# Altium project MetalDetector.PrjPcb
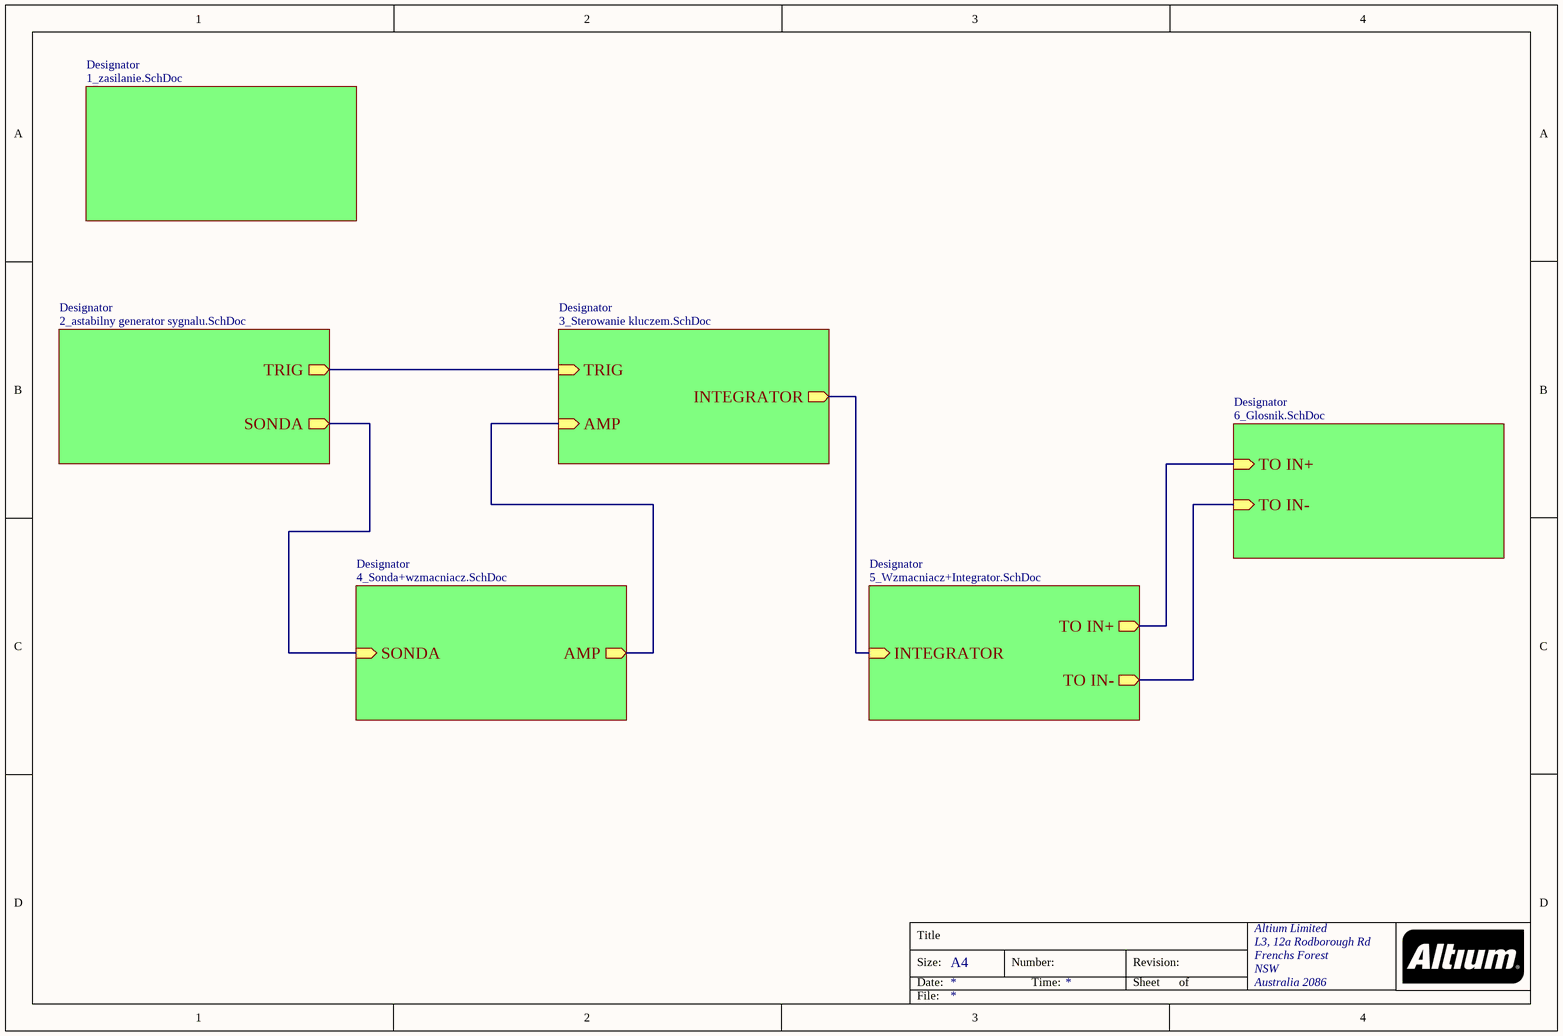
[diagram p0: Blokowy.SchDoc]
7 sheets, 64 parts. Net scope: hierarchical (ports join the sheet entries above them; power ports are global).
Board file: PCB2.PcbDoc
Sheets:
  Blokowy.SchDoc
    Designator = 1_zasilanie.SchDoc
    Designator = 2_astabilny generator sygnalu.SchDoc
    Designator = 3_Sterowanie kluczem.SchDoc
    Designator = 4_Sonda+wzmacniacz.SchDoc
    Designator = 5_Wzmacniacz+Integrator.SchDoc
    Designator = 6_Glosnik.SchDoc

## Sheet Blokowy.SchDoc
size A4; Organization: Altium Limited; Address1: L3, 12a Rodborough Rd; Address2: Frenchs Forest; Address3: NSW; Address4: Australia 2086

### Sub-sheets
Designator = 1_zasilanie.SchDoc: no entries
Designator = 2_astabilny generator sygnalu.SchDoc: TRIG (out), SONDA (out)
Designator = 3_Sterowanie kluczem.SchDoc: TRIG (in), AMP (in), INTEGRATOR (out)
Designator = 4_Sonda+wzmacniacz.SchDoc: SONDA (in), AMP (out)
Designator = 5_Wzmacniacz+Integrator.SchDoc: INTEGRATOR (in), TO IN+ (out), TO IN- (out)
Designator = 6_Glosnik.SchDoc: TO IN+ (in), TO IN- (in)

### Nets
NetC14_1: sheet Designator/AMP, sheet Designator/AMP
NetP2_1: sheet Designator/SONDA, sheet Designator/SONDA
NetPR2_3: sheet Designator/INTEGRATOR, sheet Designator/INTEGRATOR
NetR3_1: sheet Designator/TRIG, sheet Designator/TRIG
NetR16_1: sheet Designator/TO IN-, sheet Designator/TO IN-
NetR18_1: sheet Designator/TO IN+, sheet Designator/TO IN+

### Notes on the sheet
- Title
- Size:
- Date:
- A4
- Number:
- Time:
- Revision:
- Sheet
- of
- File:

## Sheet 1_zasilanie.SchDoc
size A4
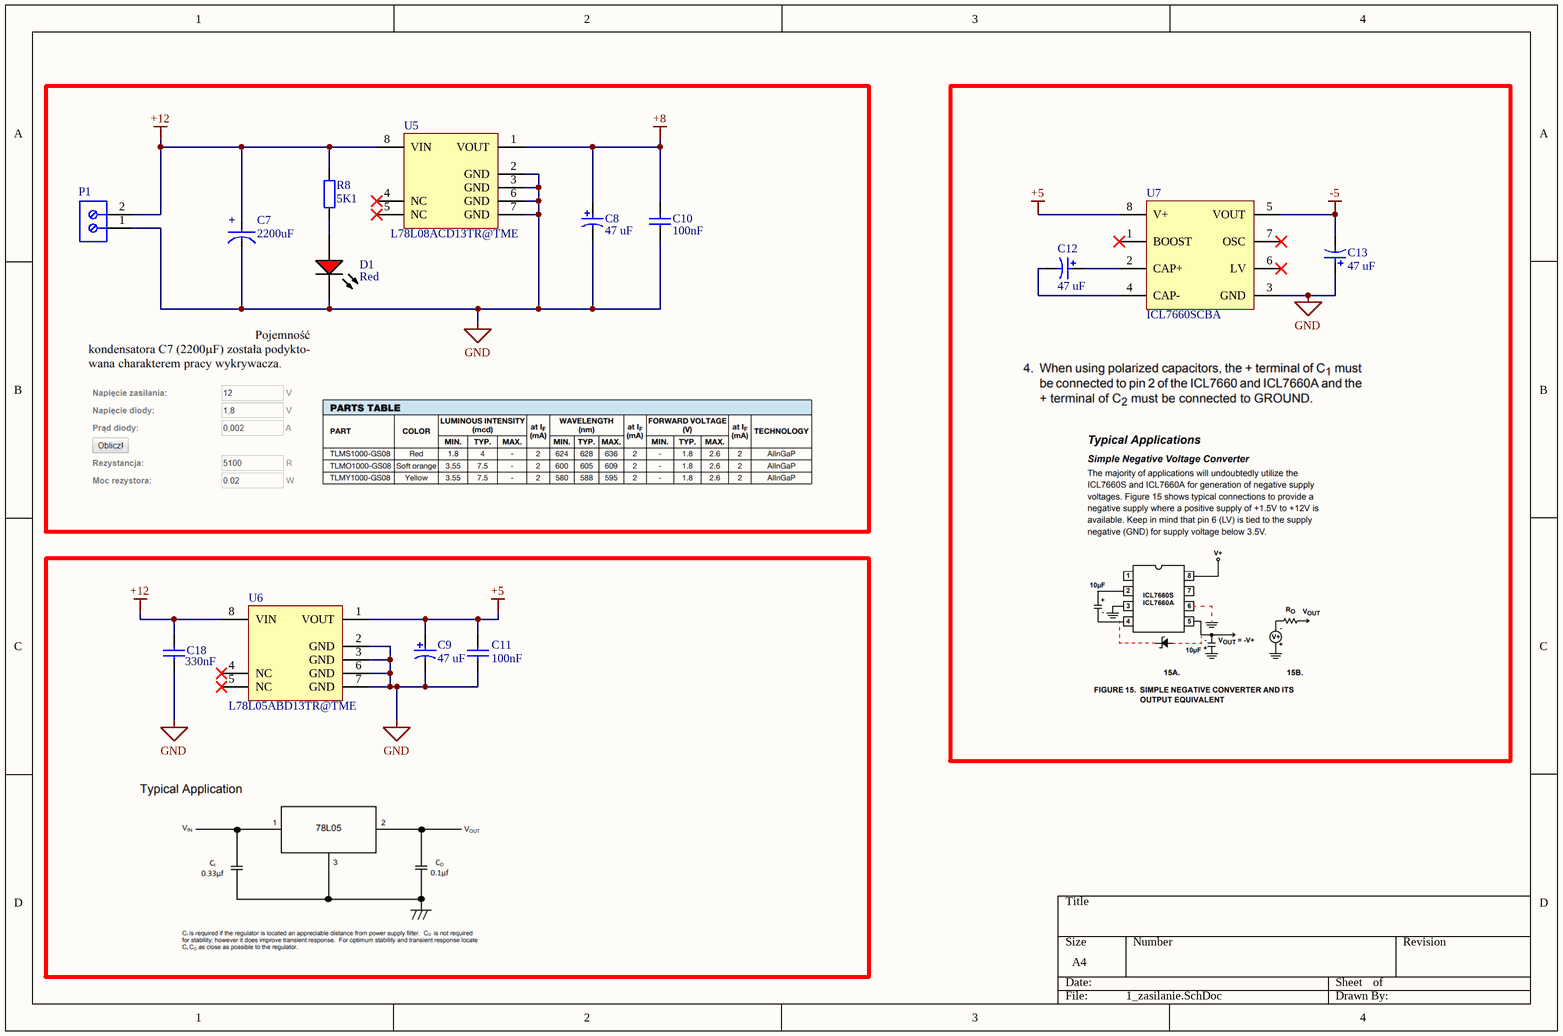
[diagram p1: 1_zasilanie.SchDoc]

### Parts
C7  Capacitance: 2200uF  [18 X 25mm Radial 7.5mm]  (hidden comment: Cap Electrolytic)
C8  Rated Capacitance: 47 uF  [NIC-CAPA2-6.3X5.8_V]  (hidden comment: UUD1E470MCL1GS)
C9  Rated Capacitance: 47 uF  [NIC-CAPA2-6.3X5.8_V]  (hidden comment: UUD1E470MCL1GS)
C10  Capacitance: 100nF  [0603]  (hidden comment: CL10B104KA8NNNC@TME)
C11  Capacitance: 100nF  [0603]  (hidden comment: CL10B104KA8NNNC@TME)
C12  Rated Capacitance: 47 uF  [NIC-CAPA2-6.3X5.8_V]  (hidden comment: UUD1E470MCL1GS)
C13  Rated Capacitance: 47 uF  [NIC-CAPA2-6.3X5.8_V]  (hidden comment: UUD1E470MCL1GS)
C18  value 330nF  [CAPC1608X90X35ML15T15]  (hidden comment: 0603YD334KAT2A)
D1  LED Colour: Red  [VISH-TLMS1000_V]  (hidden comment: TLMS1000-GS08)
P1  282836-2@TME  [TECO-282836-2_V]  (value not drawn)
R8  value 5K1  [R1206]  (hidden comment: 1206S4J0102T5E@TME)
U5  L78L08ACD13TR@TME  [SO8_M]
U6  L78L05ABD13TR@TME  [SO8_N]
U7  ICL7660SCBA  [INTS-SOIC-8_V]

### Nets
+5: C9.1 C11.1 U6.1(VOUT) U7.8(V+)
+8: C8.1 C10.1 U5.1(VOUT)
+12: C7.2(+) C18.1 P1.2(-) R8.2 U5.8(VIN) U6.8(VIN)
-5: C13.2 U7.5(VOUT)
GND: C7.1(-) C8.2 C9.2 C10.2 C11.2 C13.1 C18.2 D1.2(K) P1.1(+) U5.2(GND) U5.3(GND) U5.6(GND) U5.7(GND) U6.2(GND) U6.3(GND) U6.6(GND) U6.7(GND) U7.3(GND)
NetC12_1: C12.1 U7.2(CAP+)
NetC12_2: C12.2 U7.4(CAP-)
NetD1_1: D1.1(A) R8.1

Not connected (* = marked no-connect by the designer): U5 4(NC)* 5(NC)*; U6 4(NC)* 5(NC)*; U7 1(BOOST)* 6(LV)* 7(OSC)*

### Library data of the parts
C7 = Cap Electrolytic: CAPACITOR ALUM 2200UF 20% 35V RADIAL
C8 C9 C12 C13 = CMP-0687-00039-1: Aluminum Electrolytic Capacitor, UD Series, Low Impedance, 47 uF, 25 V, + / - 20%, -55 to 105 degC, Chip Type, 6.3 x 5.8 mm D x L, Pb-Free, Reel; Manufacturer: Nichicon; Rated Ripple Current (at 100kHz): 230 mA; Endurance Time: 2000 h; Packing: Dia382mm Reel; Rated Voltage: 25 V; Impedance: 0.44 Ohm; Tolerance Rated Capacitance: -20 to 20%; Mounting Technology: Surface Mount; Diameter: 6.3 mm; PartNumber: UUD1E470MCL1GS; ComponentLink3Description: Package Specification; ComponentLink2Description: Datasheet; PackageReference: CAPAE-D6.3H5.8; RoHS: TRUE; Length: 5.8 mm; ComponentLink1URL: http://www.nichicon.co.jp/; PackageDescription: 2-Pin Surface Mount Device, Diameter 6.3 mm, Height 5.8 mm, Pitch 5.4 mm; ComponentLink2URL: http://products.nichicon.co.jp/en/pdf/XJA043/e-ud.pdf; ComponentLink1Description: Manufacturer URL; ComponentLink3URL: http://products.nichicon.co.jp/en/pdf/XJA043/e-ud.pdf; DatasheetVersion: 08/2012
C10 C11 = Cap: Capacitor
C18 = CMP-2006-04538-1: Manufacturer: AVX Interconnect / Elco; Part Number: 0603YD334KAT2A
D1 = CMP-2000-07254-1: Low Current LED, 40 mW, 1.8 V, -40 to 100 degC, 2-Pin SMD (0603), RoHS, Tape and Reel; Manufacturer: Vishay; Lens Shape: Rectangular; Automotive Qualification Standard: AEC-Q100; Wavelength Typ: 636nm; SVHC: ToBeAdvised; Bulb Size: 1.6mmx0.8mm; Forward Voltage: 1.8V; Luminous Intensity: 4mcd; Forward Current If: 2mA; Viewing Angle: 80°; Datasheet Version: Rev. 1.7, 02/2011; Datasheet URL: https://datasheet.ciiva.com/5798/1698881-5798337.pdf; LED Mounting: SMD; Packaging: CutTape; Package Reference: TLMS1000; Manufacturer URL: http://www.vishay.com/; Mounting Technology: SurfaceMount; Product Range: -; Package Description: 2-Pin Surface Mount Device, Body 1.6 x 0.8 mm; MSL: MSL2-1year
P1 = CMP-1684-00017-1: Female Header, Pitch 5 mm, 1 x 2 Position, Height 10 mm, Tail Length 3.5 mm, Rohs, Bulk; Manufacturer: TE Connectivity; Wire Gauge: 16-30AWG; Product Training Modules: Wire-to-BoardEurostyleTerminalBlocks; Clamp Material - Plating: Brass-NickelPlated; Voltage: 300V; Mating Orientation: HorizontalwithBoard; Current: 13.5A; Pitch: 0.197"(5.00mm); Screw Thread: M3; 3D Model: 282836-2.pdf; Other Names: 5ULV-02B / A98076; Dynamic Catalog: BuchananSeries; Number of Levels: 1; Torque - Screw: 0.68Nm(6Lb-In); Featured Product: EurostyleTerminalBlockConnectors; Positions Per Level: 2; Wire Termination: Screw-RisingCageClamp; Datasheet URL: http://www.te.com.cn/commerce/DocumentDelivery/DDEController?Action=showdoc&DocId=Catalog+Section%7F1308389_EUROSTYLE_TERMINAL_BLOCKS%7F0607%7Fpdf%7FEnglish%7FENG_CS_1308389_EUROSTYLE_TERMINAL_BLOCKS_0607.pdf%7F282836-2; Color: Green; Family: TerminalBlocks-WiretoBoard; RoHS Information: 282836-2StatementofCompliance; Standard Package: 300; Contact Material - Plating: Brass-TinPlated; Manufacturer URL: http://www.te.com; Housing Material: Polyamide(PA66),Nylon6/6; Features: Interlocking(Side); Package Description: Female Header, Pitch 5 mm, 1 x 2 Position, Height 10 mm, Tail Length 3.5 mm; Mounting Type: ThroughHole; Package Reference: THD; Packaging: Bulk; Series: Buchanan; Category: Connectors,Interconnects; Screw Material - Plating: Brass-NickelPlated
R8 = Res: Resistor
U5 = CMP-0244-00234-1: Positive Voltage Regulator, 8V, 8-Pin SO, Tape and Reel; PackageVersion: 1/12/2002; DatasheetVersion: 1/02/2011; Code_IPC: SOIC127P600-8; PackageDescription: 8-Pin Small Outline Integrated Circuit 1.27 mm Pitch; ComponentLink3Description: Package Specification; Code_JEDEC: MS-012-AA; PackageReference: SO8; ComponentLink3URL: http://www.st.com/internet/com/TECHNICAL_RESOURCES/TECHNICAL_LITERATURE/PACKAGE_INFORMATION/CD00004680.pdf; ComponentLink1Description: Manufacturer URL; ComponentLink2Description: Datasheet; ComponentLink2URL: http://www.st.com/internet/com/TECHNICAL_RESOURCES/TECHNICAL_LITERATURE/DATASHEET/CD00000446.pdf; ComponentLink1URL: http://www.st.com
U6 = CMP-0244-00242-1: Positive Voltage Regulator, 5V, 8-Pin SO, Tape and Reel; ComponentLink2URL: http://www.st.com/internet/com/TECHNICAL_RESOURCES/TECHNICAL_LITERATURE/DATASHEET/CD00000446.pdf; ComponentLink3URL: http://www.st.com/internet/com/TECHNICAL_RESOURCES/TECHNICAL_LITERATURE/PACKAGE_INFORMATION/CD00004680.pdf; Code_IPC: SOIC127P600-8; PackageDescription: 8-Pin Small Outline Integrated Circuit 1.27 mm Pitch; ComponentLink3Description: Package Specification; ComponentLink2Description: Datasheet; DatasheetVersion: 1/02/2011; PackageVersion: 1/12/2002; Code_JEDEC: MS-012-AA; ComponentLink1URL: http://www.st.com; ComponentLink1Description: Manufacturer URL; PackageReference: SO8
U7 = CMP-2000-06437-1: Charge Pump Switching Regulator IC Positive or Negative Fixed, 1.5 to 12 V, 0 to 70 degC, RoHS, Tube; Manufacturer: Intersil; Number of Outputs: 1; Frequency - Switching: 10kHz,35kHz; Dynamic Catalog: InvertingIC; Current - Output: 45mA; Voltage - Input: 1.5V~12V; Output Type: Adjustable; Synchronous Rectifier: No; Voltage - Output: -1.5V~-12V,±3V~±24V; Package URL: http://www.intersil.com/content/dam/Intersil/documents/m8_1/m8.15.pdf; Standard Package: 98; Type: SwitchedCapacitor(ChargePump),Doubler,Inverting; Datasheet Version: 01/2013; Package Description: 8-Pin Small Outline Integrated Circuit, Body 4.9 x 3.9 mm, Pitch 1.27 mm; Category: IntegratedCircuits(ICs); Operating Temperature: 0°C~70°C; Mounting Technology: SurfaceMount; Package / Case: 8-SOIC(0.154",3.90mmWidth); Mounting Type: SurfaceMount; Series: -; Family: PMIC-VoltageRegulators-DCDCSwitchingRegulators; Packaging: Tube; PWM Type: -; Supplier Device Package: 8-SOIC; Datasheet URL: http://www.intersil.com/content/dam/intersil/documents/icl7/icl7660s-a.pdf; Package Reference: SOIC-8; Manufacturer URL: http://www.intersil.com/en.html

## Sheet 2_astabilny generator sygnalu.SchDoc
size A4
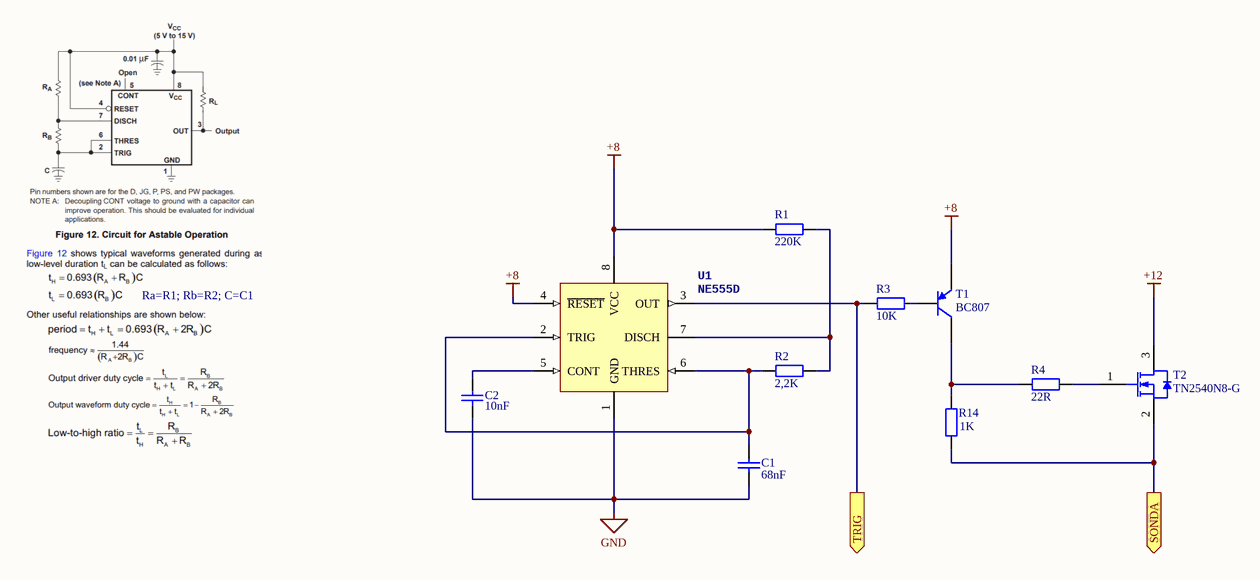
[diagram p2: 2_astabilny generator sygnalu.SchDoc]

### Parts
C1  Capacitance: 68nF  [CAPC1608X95X40NL15T15]  (hidden comment: VJ0603Y683KXJCW1BC)
C2  Capacitance: 10nF  [CAPC1608X92X38NL15T08]  (hidden comment: VJ0603Y103KNAAO)
R1  value 220K  [R1206]  (hidden comment: 1206S4J0224T5E@TME)
R2  value 2,2K  [R1206]  (hidden comment: 1206S4J0222T5E@TME)
R3  value 10K  [R1206]  (hidden comment: 1206S4J0103T5E@TME)
R4  value 22R  [R1206]  (hidden comment: 1206S4J0220T5E@TME)
R14  value 1K  [R1206]  (hidden comment: 1206S4J0102T5E@TME)
T1  BC807  [ONSC-SOT-23-3-318-08_V]
T2  TN2540N8-G  [FAIR-SOT23-3_A_V]
U1  NE555D  [D0008A_N]

### Ports
SONDA (out), TRIG (out)

### Nets
+8: R1.1 T1.2(E) U1.4(~{RESET}) U1.8(VCC)
+12: T2.3(D)
GND: C1.1 C2.1 U1.1(GND)
NetC1_2: C1.2 R2.1 U1.2(TRIG) U1.6(THRES)
NetC2_2: C2.2 U1.5(CONT)
NetP2_1: R14.1 T2.2(S) ; port SONDA
NetR1_2: R1.2 R2.2 U1.7(DISCH)
NetR3_1: R3.1 U1.3(OUT) ; port TRIG
NetR3_2: R3.2 T1.1(B)
NetR4_1: R4.1 R14.2 T1.3(C)
NetR4_2: R4.2 T2.1(G)

### Notes on the sheet
- Ra=R1; Rb=R2; C=C1

### Library data of the parts
C1 = CMP-2006-01832-1: Manufacturer: Vitramon; Part Number: VJ0603Y683KXJCW1BC
C2 = CMP-2006-01968-1: Manufacturer: Vitramon; Part Number: VJ0603Y103KNAAO
R1-R4 R14 = Res: Resistor
T1 = CMP-1048-00691-1: General Purpose Transistor, PNP Silicon, 3-Pin SOT-23, Pb-Free, Tape and Reel; Manufacturer: On Semiconductor; PartNumber: BC807-25LT1G; IC Continuous (A): -0.5; fT Min (MHz): 100; PackageDescription: 3-Pin Small Outline Transistor, Body 2.92 x 1.3 mm, Pitch 0.95 mm; Polarity: PNP; ComponentLink2URL: http://www.onsemi.com/pub_link/Collateral/BC807-16LT1-D.PDF; PackageReference: SOT-23-3-318-08; ComponentLink2Description: Datasheet; ComponentLink1Description: Manufacturer URL; ComponentLink3URL: http://www.onsemi.cn/pub_link/Collateral/318-08.PDF; Packing: Tape and Reel; DatasheetVersion: Rev. 10; RoHS: TRUE; ComponentLink3Description: Package Specification; PackageVersion: Rev. AP, 11/2009; ComponentLink1URL: http://www.onsemi.com/; Mounting Technology: Surface Mount
T2 = CMP-2000-06254-1: N-Channel Logic Level PowerTrench(TM) MOSFET, 30 V, 2.7 A, -55 to 150 degC, 3-Pin SOT23, RoHS, Tape and Reel; Manufacturer: FairchildSemiconductor; RDS-on: 46@10VmOhm; Rad Hard: No; Typical Turn-On Delay Time: 6ns; Typical Fall Time: 4ns; Channel Mode: Enhancement; Channel Type: N; Maximum Drain Source Voltage: 30V; Maximum Continuous Drain Current: 2.7A; Typical Rise Time: 13ns; Typical Turn-Off Delay Time: 15ns; Maximum Gate Source Voltage: ±20V; Package: 3SuperSOT; Category: MOSFET; Datasheet Version: Rev. C, 04/1999; Packaging: Tape&Reel; Operating Temperature: -55to150°C; Package Reference: SOT23-3; Datasheet URL: https://www.fairchildsemi.com/datasheets/FD/FDN359AN.pdf; Manufacturer URL: https://www.fairchildsemi.com/; Mounting: SurfaceMount; Mounting Technology: SurfaceMount; Package Description: 3-Pin Small Outline Transistor, Body 2.92 x 1.4 mm, Pitch 0.95 mm; Package URL: https://www.fairchildsemi.com/package-drawings/MA/MA03B.pdf
U1 = CMP-2000-06840-1: Precision Timer, 4.5 to 16 V, 0 to 70 degC, 8-Pin SOIC (D), Green (RoHS & no Sb/Br), Tube; PartNumber: NE555; Manufacturer: Texas Instruments; Base Number: 555; No. of Timers: 1; Supply Voltage Min: 4.5V; Operating Frequency Max: 0.5MHz; Supply Voltage Range: 4.5Vto16V; No. of Pins: 8; Supply Voltage Max: 16V; IC Temperature Range: Commercial; SVHC: NoSVHC(19-Dec-2012); Operating Mode: Astable,Monostable; Frequency: 500kHz; Package Description: 8-Pin Small Outline Integrated Circuit, Body 4.9 x 3.9 mm, Pitch 1.27 mm; Datasheet URL: http://www.ti.com/general/docs/lit/getliterature.tsp?genericPartNumber=NE555&fileType=pdf; Mounting Technology: SurfaceMount; Operating Temperature Range: 0°Cto+70°C; Operating Temperature Min: 0°C; Package URL: http://www.ti.com/lit/ml/msoi002j/msoi002j.pdf; Datasheet Version: Rev. I, 09/2014; Manufacturer URL: http://www.ti.com/; Digital IC Case Style: SOIC; Clock External Input: No; Logic Function Number: 555; IC Generic Number: 555; No. of Channels: 1; Operating Temperature Max: 70°C; Package / Case: SOIC; Package Reference: D8; Device Marking: NE555D

## Sheet 3_Sterowanie kluczem.SchDoc
size A4
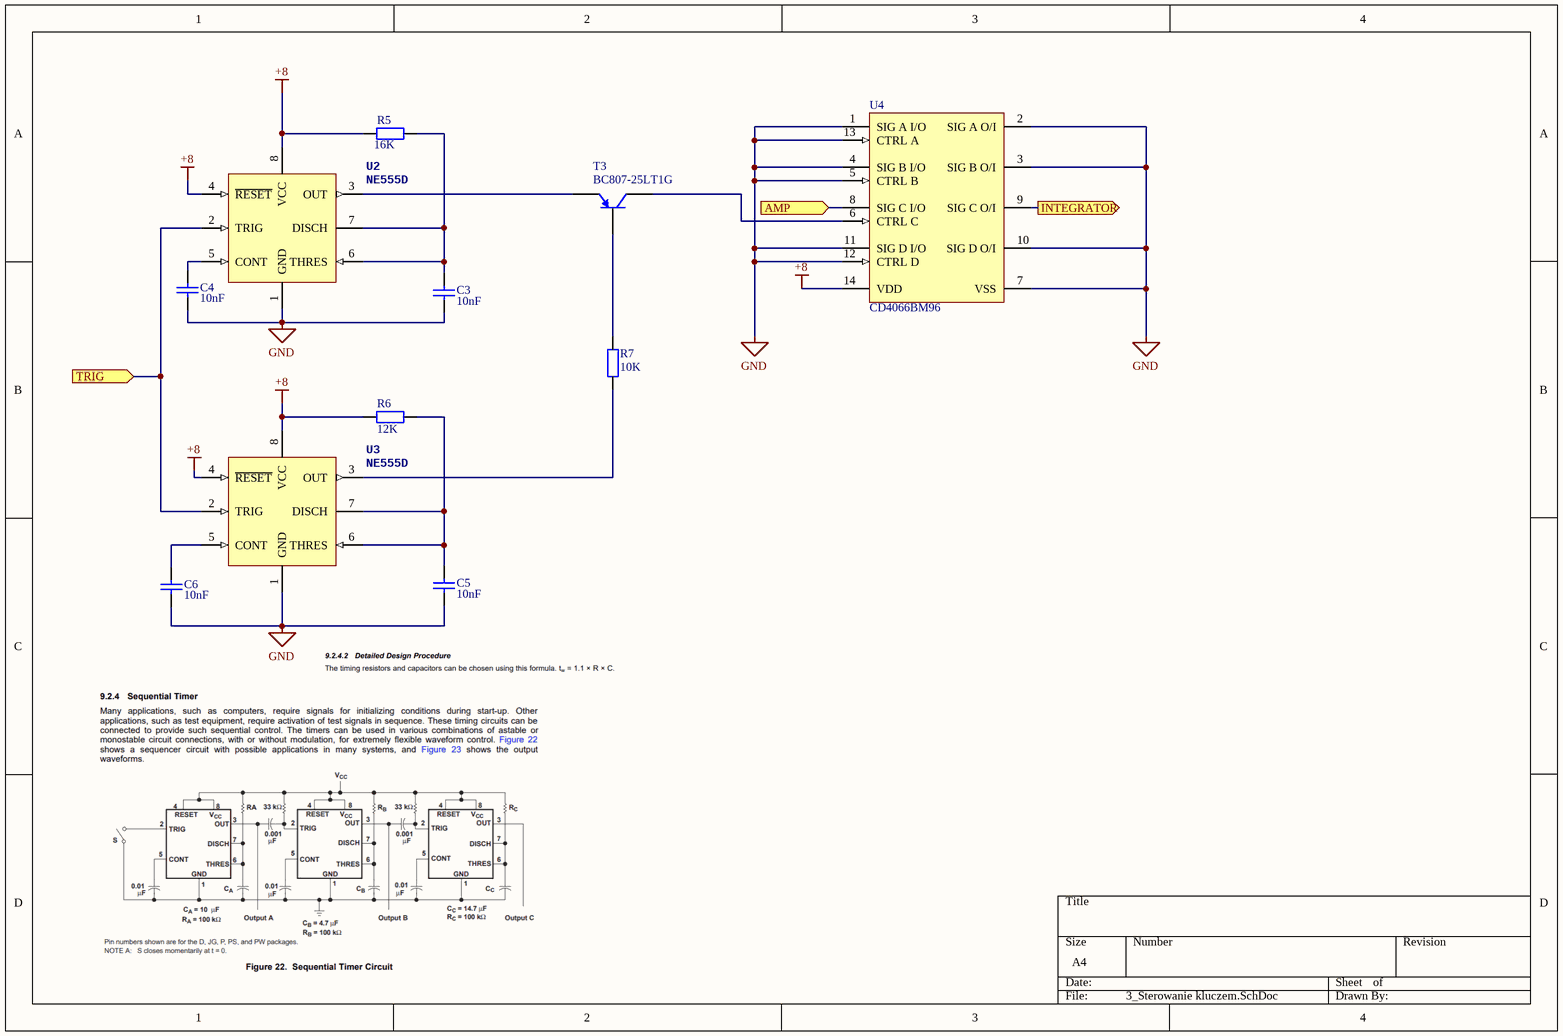
[diagram p3: 3_Sterowanie kluczem.SchDoc]

### Parts
C3  Capacitance: 10nF  [CAPC1608X92X38NL15T08]  (hidden comment: VJ0603Y103KNAAO)
C4  Capacitance: 10nF  [CAPC1608X92X38NL15T08]  (hidden comment: VJ0603Y103KNAAO)
C5  Capacitance: 10nF  [CAPC1608X92X38NL15T08]  (hidden comment: VJ0603Y103KNAAO)
C6  Capacitance: 10nF  [CAPC1608X92X38NL15T08]  (hidden comment: VJ0603Y103KNAAO)
R5  value 16K  [R1206]  (hidden comment: 1206S4J0163T5E@TME)
R6  value 12K  [R1206]  (hidden comment: 1206S4J0123T5E@TME)
R7  value 10K  [R1206]  (hidden comment: Resistor)
T3  BC807-25LT1G  [ONSC-SOT-23-3-318-08_V]
U2  NE555D  [D0008A_N]
U3  NE555D  [D0008A_N]
U4  CD4066BM96  [D0014A_M]

### Ports
AMP (in), INTEGRATOR (out), TRIG (in)

### Nets
+8: R5.1 R6.1 U2.4(~{RESET}) U2.8(VCC) U3.4(~{RESET}) U3.8(VCC) U4.14(VDD)
GND: C3.1 C4.1 C5.1 C6.1 U2.1(GND) U3.1(GND) U4.1(SIG_A_I/O) U4.2(SIG_A_O/I) U4.3(SIG_B_O/I) U4.4(SIG_B_I/O) U4.5(CTRL_B) U4.7(VSS) U4.10(SIG_D_O/I) U4.11(SIG_D_I/O) U4.12(CTRL_D) U4.13(CTRL_A)
NetC3_2: C3.2 R5.2 U2.6(THRES) U2.7(DISCH)
NetC4_2: C4.2 U2.5(CONT)
NetC5_2: C5.2 R6.2 U3.6(THRES) U3.7(DISCH)
NetC6_2: C6.2 U3.5(CONT)
NetC14_1: U4.8(SIG_C_I/O) ; port AMP
NetPR2_3: U4.9(SIG_C_O/I) ; port INTEGRATOR
NetR3_1: U2.2(TRIG) U3.2(TRIG) ; port TRIG
NetR7_1: R7.1 U3.3(OUT)
NetR7_2: R7.2 T3.1(B)
NetT3_2: T3.2(E) U2.3(OUT)
NetT3_3: T3.3(C) U4.6(CTRL_C)

### Library data of the parts
C3-C6 = CMP-2006-01968-1: Manufacturer: Vitramon; Part Number: VJ0603Y103KNAAO
R5 R6 = Res2: Resistor; Published: 8-Jun-2000; LatestRevisionDate: 17-Jul-2002; LatestRevisionNote: Re-released for DXP Platform.; PackageReference: AXIAL-0.4; Publisher: Altium Limited; PackageDescription: Axial Device, Thru-Hole; 2 Leads; 0.4 in Pin Spacing
R7 = Res
T3 = CMP-1048-00691-1: General Purpose Transistor, PNP Silicon, 3-Pin SOT-23, Pb-Free, Tape and Reel; Manufacturer: On Semiconductor; IC Continuous (A): -0.5; fT Min (MHz): 100; PackageDescription: 3-Pin Small Outline Transistor, Body 2.92 x 1.3 mm, Pitch 0.95 mm; Polarity: PNP; ComponentLink2URL: http://www.onsemi.com/pub_link/Collateral/BC807-16LT1-D.PDF; PackageReference: SOT-23-3-318-08; ComponentLink2Description: Datasheet; ComponentLink1Description: Manufacturer URL; PartNumber: BC807-25LT1G; ComponentLink3URL: http://www.onsemi.cn/pub_link/Collateral/318-08.PDF; Packing: Tape and Reel; DatasheetVersion: Rev. 10; RoHS: TRUE; ComponentLink3Description: Package Specification; PackageVersion: Rev. AP, 11/2009; ComponentLink1URL: http://www.onsemi.com/; Mounting Technology: Surface Mount
U2 U3 = CMP-2000-06840-1: as U1 on sheet 2_astabilny generator sygnalu; Package Description: 8-Pin Small Outline Integrated Circuit, Body 4.9 x 3.9 mm, Pitch 1.27 mm; Datasheet URL: http://www.ti.com/general/docs/lit/getliterature.tsp?genericPartNumber=NE555&fileType=pdf; Mounting Technology: SurfaceMount; Operating Temperature Range: 0°Cto+70°C; Operating Temperature Min: 0°C; Package URL: http://www.ti.com/lit/ml/msoi002j/msoi002j.pdf; Datasheet Version: Rev. I, 09/2014; Manufacturer URL: http://www.ti.com/; Digital IC Case Style: SOIC; Clock External Input: No; Logic Function Number: 555; IC Generic Number: 555; No. of Channels: 1; Operating Temperature Max: 70°C; Package / Case: SOIC; Package Reference: D8; Device Marking: NE555D
U4 = CMP-1574-00003-3: CMOS Quad Bilateral Switch, D0014A, LARGE T&R; Manufacturer: Texas Instruments; Configuration: 4 X SPST (NO); Crosstalk: Yes; Ron(Max)(Ohms): 240; ICC(Typ)(mA): 0.00002; VCC(Min)(V): 3; Rating: Military; Ron(Typ)(Ohms): 125; Bandwidth(Max)(MHz): 40; VCC(Max)(V): 18; Operating Temperature Range(C): -55 to 125; Code_JEDEC: MS-012; DatasheetVersion: SCHS051D; PackageReference: D0014A; Output Type: CMOS; Generic Part Number: CD4066B; PackageVersion: http://www.ti.com/lit/ml/mpds177g/mpds177g.pdf

## Sheet 4_Sonda+wzmacniacz.SchDoc
size A4
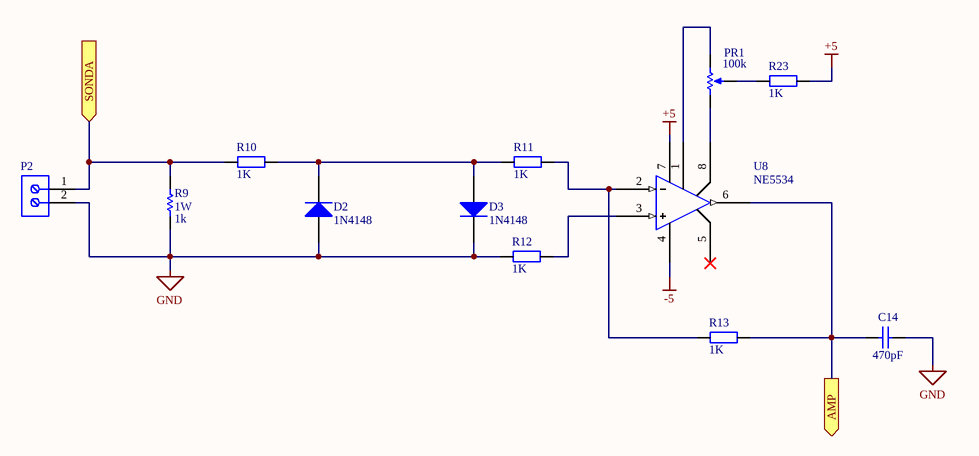
[diagram p4: 4_Sonda+wzmacniacz.SchDoc]

### Parts
C14  Capacitance: 470pF  [KEMT-C315-THT-2]  (hidden comment: CC-470@TME)
D2  1N4148  [DIOD-SOD323-2-A_V]
D3  1N4148  [DIOD-SOD323-2-A_V]
P2  282836-2 / SONDA  [TECO-282836-2_V]  (value not drawn)
PR1  Resistance: 100k  [BOUR-3296W]  (hidden comment: 3296W-1-104LF@TME)
R9  1W  Resistance (Ohms): 1k  [OMTE-RES7X2.5-2]
R10  value 1K  [R1206]  (hidden comment: Resistor)
R11  value 1K  [R1206]  (hidden comment: Resistor)
R12  value 1K  [R1206]  (hidden comment: Resistor)
R13  value 1K  [R1206]  (hidden comment: Resistor)
R23  value 1K  [R1206]  (hidden comment: Resistor)
U8  NE5534  [NE5534 FIXED]

### Ports
AMP (out), SONDA (in)

### Nets
+5: R23.2 U8.7(VCC+)
-5: U8.4(VCC-)
GND: C14.2 D2.1(A) D3.2(K) P2.2 R9.1 R12.1
NetC14_1: C14.1 R13.2 U8.6(OUT) ; port AMP
NetD2_2: D2.2(K) D3.1(A) R10.2 R11.1
NetP2_1: P2.1 R9.2 R10.1 ; port SONDA
NetPR1_1: PR1.1(CCW) U8.8(COMP/BAL)
NetPR1_2: PR1.2(S) R23.1
NetPR1_3: PR1.3(CW) U8.1(BALANCE)
NetR11_2: R11.2 R13.1 U8.2(IN-)
NetR12_2: R12.2 U8.3(IN+)

Not connected (* = marked no-connect by the designer): U8 5(COMP)*

### Library data of the parts
C14 = CMP-1664-00008-1: Capacitor, Ceramic, 22 pF, +/-10 %, 100 V, -55 to 125 degC, 2-Pin THD, RoHS, Bulk; Max Input Voltage: 40 V; Min Input Voltage: 4.2 V; Output Current: 1.5 A; Output Voltage: 1.2 V; Outputs: 1; Case\Package: TO-220; RoHSCompliant: true; Min Operating Temperature: 0 degC; Max Operating Temperature: 125 degC; Package Quantity: 50; ComponentLink2URL: http://capacitoredge.kemet.com/capedge2/DataSheet/Datasheet-C315C220K1G5TA.pdf?pn=C315C220K1G5TA{BULK}; Radiation Hardening: No; Pins: 3; Length: 10.28 mm; ComponentLink1URL: http://www.kemet.com/; ComponentLink2Description: Datasheet; Height: 9.28 mm; REACH SVHC: No SVHC; ComponentLink1Description: Manufacturer URL; Max Ouput Current: 1.5 A; Weight: 0.08113 oz; Packaging: Rail/Tube; DatasheetVersion: Aug-16; Mount: Through Hole; PackageReference: C315-THT-2; Width: 4.82 mm; PackageDescription: 2-Pin Through Hole Device, Body 3.81 x 2.54 mm
D2 D3 = CMP-1667-00004-1: 1N4148WS-7-F / Fast Switching Diode, 75 V, 0.3 A, -65 to 150 degC, 2-Pin SOD323, RoHS, Tape and Reel; DatasheetVersion: Rev. 25-2, 03/2016; PackageDescription: 2-Pin Small Outline Diode, Body 1.7 x 1.3 mm; ComponentLink2Description: Datasheet; ComponentLink1URL: http://www.diodes.com/; PackageReference: SOD323-2; ComponentLink2URL: http://www.diodes.com/datasheets/ds30097.pdf; ComponentLink1Description: Manufacturer URL
P2 = CMP-1684-00017-1: as P1 on sheet 1_zasilanie; Datasheet URL: http://www.te.com.cn/commerce/DocumentDelivery/DDEController?Action=showdoc&DocId=Catalog+Section%7F1308389_EUROSTYLE_TERMINAL_BLOCKS%7F0607%7Fpdf%7FEnglish%7FENG_CS_1308389_EUROSTYLE_TERMINAL_BLOCKS_0607.pdf%7F282836-2; Color: Green; Family: TerminalBlocks-WiretoBoard; RoHS Information: 282836-2StatementofCompliance; Standard Package: 300; Contact Material - Plating: Brass-TinPlated; Manufacturer URL: http://www.te.com; Housing Material: Polyamide(PA66),Nylon6/6; Features: Interlocking(Side); Package Description: Female Header, Pitch 5 mm, 1 x 2 Position, Height 10 mm, Tail Length 3.5 mm; Mounting Type: ThroughHole; Package Reference: THD; Packaging: Bulk; Series: Buchanan; Category: Connectors,Interconnects; Screw Material - Plating: Brass-NickelPlated
PR1 = CMP-1747-00001-1: Square Trimpot(R) Trimming Potentiometer, 10 KOhm, +/- 10%, 0.5 W, -55 to 125 degC, 3-Pin THD, RoHS, Tube; Voltage Rating: 75 V; Tolerance: 1%; Power Rating: 100 mW; Case\Package: 0603; Type (Resistor): Thick Film; PackageDescription: 3-Pin Through Hole Device, Body 9.53 x 4.83 mm, Pitch 2.54 mm; RoHSCompliant: true; Package Quantity: 5000; Case Code (Metric): 1608; PackageReference: 3296W; ComponentLink2Description: Datasheet; REACH SVHC: Unknown; Case Code (Imperial): 0603; ComponentLink1URL: http://www.bourns.com/; Width: 0.85 mm; Radiation Hardening: No; Min Operating Temperature: -55 degC; Mount: Surface Mount; ComponentLink1Description: Manufacturer URL; Max Operating Temperature: 155 degC; Weight: 7.1E-05 oz; Pins: 2; DatasheetVersion: May-16; Packaging: Tape and Reel; Height: 0.45 mm; Length: 1.55 mm; ComponentLink2URL: http://www.bourns.com/docs/Product-Datasheets/3296.pdf
R9 = CMP-2000-06865-1: PartNumber: OD103JE; Manufacturer: Ohmite; Power Rating: 0.25W; Power (Watts): 0.25W,1/4W; Tolerance: ±5%; Online Catalog: OD,OF,OASeries,LittleDemon®; Catalog Drawings: OD,OF,OASeries; EDA / CAD Models: DownloadfromAcceleratedDesigns; Mounting Technology: ThroughHole; Datasheet Version: 06/2016; RoHS Information: LittleDemon"E"SeriesMaterialDeclaration; Number of Terminations: 2; Temperature Coefficient: -; Height: -; Composition: CarbonComposition; Package Description: 2-Pin THD Resistor, Body 7 x 2.5 mm, Lead Dia. 0.6 mm; Size / Dimension: 0.098"Diax0.276"L(2.50mmx7.00mm); Category: Resistors; Manufacturer URL: http://www.ohmite.com/; Features: PulseWithstanding; Family: ThroughHoleResistors; Supplier Device Package: Axial; Package / Case: Axial; Standard Package: 100; Package Reference: RES7X2.5; Operating Temperature: -; Series: LittleDemon®OD; Datasheet URL: http://www.ohmite.com/cat/res_od_of_oa.pdf; Packaging: Bulk
R10-R13 R23 = Res

## Sheet 5_Wzmacniacz+Integrator.SchDoc
size A4
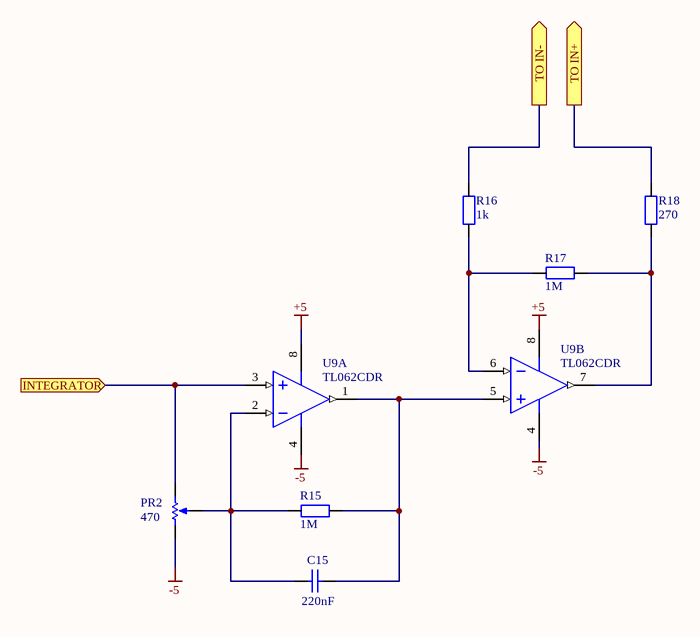
[diagram p5: 5_Wzmacniacz+Integrator.SchDoc]

### Parts
C15  Capacitance: 220nF  [KEMT-C315-THT-2]  (hidden comment: CM-220N@TME)
PR2  Resistance: 470  [BOUR-3296W]  (hidden comment: T910W-50R@TME)
R15  value 1M  [R1206]  (hidden comment: 1206S4J0105T5E@TME)
R16  value 1k  [R1206]  (hidden comment: 1206S4J0102T5E@TME)
R17  value 1M  [R1206]  (hidden comment: 1206S4J0105T5E@TME)
R18  value 270  [R1206]  (hidden comment: 1206S4J0271T5E@TME)
U9  TL062CDR  [D0008A_N]  (parts A,B of 2)

### Ports
INTEGRATOR (in), TO IN+ (out), TO IN- (out)

### Nets
+5: U9.8(VCC+)
-5: PR2.1(CCW) U9.4(VCC-)
NetC15_1: C15.1 PR2.2(S) R15.1 U9.2(IN1-)
NetC15_2: C15.2 R15.2 U9.1(OUT1) U9.5(IN2+)
NetPR2_3: PR2.3(CW) U9.3(IN1+) ; port INTEGRATOR
NetR16_1: R16.1 ; port TO IN-
NetR16_2: R16.2 R17.1 U9.6(IN2-)
NetR17_2: R17.2 R18.2 U9.7(OUT2)
NetR18_1: R18.1 ; port TO IN+

### Library data of the parts
C15 = CMP-1664-00008-1: Model: C315C220K1G5TA; Max Input Voltage: 40 V; Min Input Voltage: 4.2 V; Output Current: 1.5 A; Output Voltage: 1.2 V; Outputs: 1; Case\Package: TO-220; RoHSCompliant: true; Min Operating Temperature: 0 degC; Max Operating Temperature: 125 degC; Package Quantity: 50; ComponentLink2URL: http://capacitoredge.kemet.com/capedge2/DataSheet/Datasheet-C315C220K1G5TA.pdf?pn=C315C220K1G5TA{BULK}; Radiation Hardening: No; Pins: 3; Length: 10.28 mm; ComponentLink1URL: http://www.kemet.com/; ComponentLink2Description: Datasheet; Height: 9.28 mm; REACH SVHC: No SVHC; ComponentLink1Description: Manufacturer URL; Max Ouput Current: 1.5 A; Weight: 0.08113 oz; Packaging: Rail/Tube; DatasheetVersion: Aug-16; Mount: Through Hole; PackageReference: C315-THT-2; Width: 4.82 mm; PackageDescription: 2-Pin Through Hole Device, Body 3.81 x 2.54 mm
PR2 = CMP-1747-00001-1: as PR1 on sheet 4_Sonda+wzmacniacz; PackageDescription: 3-Pin Through Hole Device, Body 9.53 x 4.83 mm, Pitch 2.54 mm; RoHSCompliant: true; Package Quantity: 5000; Case Code (Metric): 1608; PackageReference: 3296W; ComponentLink2Description: Datasheet; REACH SVHC: Unknown; Case Code (Imperial): 0603; ComponentLink1URL: http://www.bourns.com/; Width: 0.85 mm; Radiation Hardening: No; Min Operating Temperature: -55 degC; Mount: Surface Mount; ComponentLink1Description: Manufacturer URL; Max Operating Temperature: 155 degC; Weight: 7.1E-05 oz; Pins: 2; DatasheetVersion: May-16; Packaging: Tape and Reel; Height: 0.45 mm; Length: 1.55 mm; ComponentLink2URL: http://www.bourns.com/docs/Product-Datasheets/3296.pdf
R15-R18 = Res: Resistor
U9 = CMP-0017-00600-2: Dual Low-Power JFET-Input General-Purpose Operational Amplifier, 7 to 36 V, 0 to 70 degC, 8-pin SOIC (D8), Green (RoHS & no Sb/Br); Manufacturer: Texas Instruments; Number of Channels: 2; Total Supply Voltage(Max)(+5V is 5, +/-5V is 10): 36; Vn at 1kHz(Typ)(nV/rtHz): 42; Slew Rate(Typ)(V/us): 3.5; Iq per channel(Max)(mA): 0.25; Offset Drift(Typ)(uV/C): 10; Rating: Catalog; Vio (25C)(Max)(mV): 15; Sub Family: General Purpose Amplifier, High Supply Voltage Amplifier (>=30V), Low Power Amp (<=500uA); Total Supply Voltage(Min)(+5V is 5, +/-5V is 10): 7; CMRR(Min)(dB): 70; GBW(Typ)(MHz): 1; IIB(Max)(pA): 400; ComponentLink2URL: http://www.ti.com/lit/ds/symlink/tl062.pdf; Eco-Plan: Green (RoHS & no Sb/Br); Code_JEDEC: MS-012; ComponentLink3URL: http://www.ti.com/litv/pdf/msoi002j; PackageVersion: 4040047-3/M, 06/2011; Mounting Technology: Surface Mount; DatasheetVersion: SLOS078J; ComponentLink3Description: Package Specification; PartNumber: TL062CDR; ComponentLink2Description: Datasheet; PackageReference: D0008A; PackageDescription: 8-Pin Plastic Small Outline, Body 4.9 x 3.9 mm, Pitch 1.27 mm; ComponentLink1Description: Manufacturer URL; ComponentLink1URL: http://www.ti.com/

## Sheet 6_Glosnik.SchDoc
size A4; Organization: Altium Limited; Address1: L3, 12a Rodborough Rd; Address2: Frenchs Forest; Address3: NSW; Address4: Australia 2086
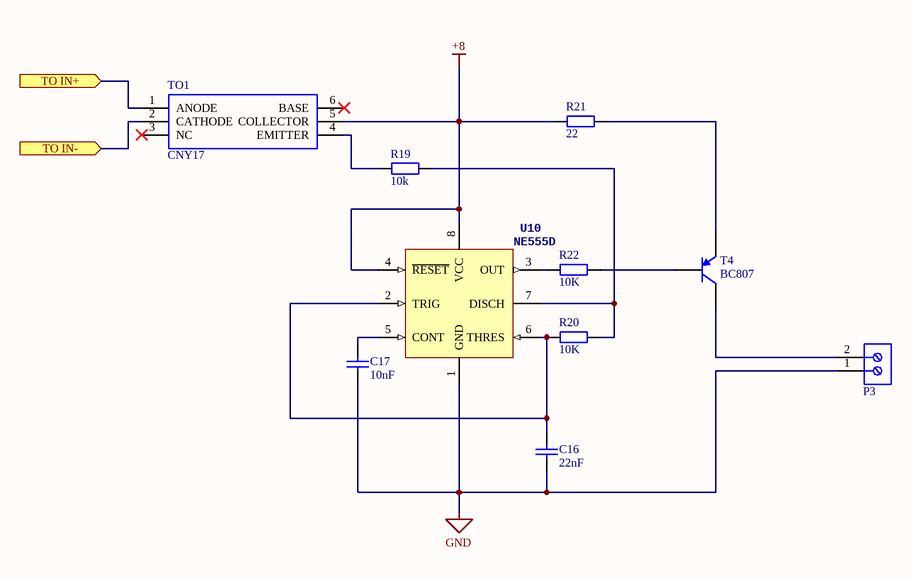
[diagram p6: 6_Glosnik.SchDoc]

### Parts
C16  Capacitance: 22nF  [CAPC1608X92X38NL15T08]  (hidden comment: VJ0603Y103KNAAO)
C17  Capacitance: 10nF  [CAPC1608X92X38NL15T08]  (hidden comment: VJ0603Y103KNAAO)
P3  282836-2 / SPEAKER  [TECO-282836-2_V]  (value not drawn)
R19  value 10k  [R1206]  (hidden comment: 1206S4J0103T5E@TME)
R20  value 10K  [R1206]  (hidden comment: 1206S4J0103T5E@TME)
R21  value 22  [R1206]  (hidden comment: 1206S4J0220T5E@TME)
R22  value 10K  [R1206]  (hidden comment: 1206S4J0103T5E@TME)
T4  BC807  [ONSC-SOT-23-3-318-08_V]
TO1  CNY17  [SOP254P1016X460-6N]
U10  NE555D  [D0008A_N]

### Ports
TO IN+ (in), TO IN- (in)

### Nets
+8: R21.2 TO1.5(COLLECTOR) U10.4(~{RESET}) U10.8(VCC)
GND: C16.2 C17.2 P3.1 U10.1(GND)
NetC16_1: C16.1 R20.2 U10.2(TRIG) U10.6(THRES)
NetC17_1: C17.1 U10.5(CONT)
NetP3_2: P3.2 T4.3(C)
NetR16_1: TO1.2(CATHODE) ; port TO IN-
NetR18_1: TO1.1(ANODE) ; port TO IN+
NetR19_1: R19.1 R20.1 U10.7(DISCH)
NetR19_2: R19.2 TO1.4(EMITTER)
NetR21_1: R21.1 T4.2(E)
NetR22_1: R22.1 T4.1(B)
NetR22_2: R22.2 U10.3(OUT)

Not connected (* = marked no-connect by the designer): TO1 3(NC)* 6(BASE)*

### Notes on the sheet
- Title
- Size:
- Date:
- A4
- Number:
- Time:
- Revision:
- Sheet
- of
- File:

### Library data of the parts
C16 C17 = CMP-2006-01968-1: Manufacturer: Vitramon; Part Number: VJ0603Y103KNAAO
P3 = CMP-1684-00017-1: as P1 on sheet 1_zasilanie; Datasheet URL: http://www.te.com.cn/commerce/DocumentDelivery/DDEController?Action=showdoc&DocId=Catalog+Section%7F1308389_EUROSTYLE_TERMINAL_BLOCKS%7F0607%7Fpdf%7FEnglish%7FENG_CS_1308389_EUROSTYLE_TERMINAL_BLOCKS_0607.pdf%7F282836-2; Color: Green; Family: TerminalBlocks-WiretoBoard; RoHS Information: 282836-2StatementofCompliance; Standard Package: 300; Contact Material - Plating: Brass-TinPlated; Manufacturer URL: http://www.te.com; Housing Material: Polyamide(PA66),Nylon6/6; Features: Interlocking(Side); Package Description: Female Header, Pitch 5 mm, 1 x 2 Position, Height 10 mm, Tail Length 3.5 mm; Mounting Type: ThroughHole; Package Reference: THD; Packaging: Bulk; Series: Buchanan; Category: Connectors,Interconnects; Screw Material - Plating: Brass-NickelPlated
R19-R22 = Res: Resistor
T4 = CMP-1048-00691-1: as T1 on sheet 2_astabilny generator sygnalu; PackageDescription: 3-Pin Small Outline Transistor, Body 2.92 x 1.3 mm, Pitch 0.95 mm; Polarity: PNP; ComponentLink2URL: http://www.onsemi.com/pub_link/Collateral/BC807-16LT1-D.PDF; PackageReference: SOT-23-3-318-08; ComponentLink2Description: Datasheet; ComponentLink1Description: Manufacturer URL; ComponentLink3URL: http://www.onsemi.cn/pub_link/Collateral/318-08.PDF; Packing: Tape and Reel; DatasheetVersion: Rev. 10; RoHS: TRUE; ComponentLink3Description: Package Specification; PackageVersion: Rev. AP, 11/2009; ComponentLink1URL: http://www.onsemi.com/; Mounting Technology: Surface Mount
TO1 = CNY17-3-300E: Optocoupler DC i/p Transistor o/p DIP6GW Avago CNY17-3-300E DC Input Transistor Output Optocoupler, Surface Mount, 6-Pin PDIP; Manufacturer_Name: Avago Technologies; Geometry.Height: 4.6mm; Mouser Part Number: 630-CNY17-3-300E; Mouser Price/Stock: https://www.mouser.com/Search/Refine.aspx?Keyword=630-CNY17-3-300E; Manufacturer_Part_Number: CNY17-3-300E; Datasheet Link: https://componentsearchengine.com/Datasheets/2/CNY17-3-300E.pdf
U10 = CMP-2000-06840-1: as U1 on sheet 2_astabilny generator sygnalu; Package Description: 8-Pin Small Outline Integrated Circuit, Body 4.9 x 3.9 mm, Pitch 1.27 mm; Datasheet URL: http://www.ti.com/general/docs/lit/getliterature.tsp?genericPartNumber=NE555&fileType=pdf; Mounting Technology: SurfaceMount; Operating Temperature Range: 0°Cto+70°C; Operating Temperature Min: 0°C; Package URL: http://www.ti.com/lit/ml/msoi002j/msoi002j.pdf; Datasheet Version: Rev. I, 09/2014; Manufacturer URL: http://www.ti.com/; Digital IC Case Style: SOIC; Clock External Input: No; Logic Function Number: 555; IC Generic Number: 555; No. of Channels: 1; Operating Temperature Max: 70°C; Package / Case: SOIC; Package Reference: D8; Device Marking: NE555D

## Nets that join several sheets
+5: 1_zasilanie (C9.1 C11.1 U6.1 U7.8), 4_Sonda+wzmacniacz (R23.2 U8.7), 5_Wzmacniacz+Integrator (U9.8)
+8: 1_zasilanie (C8.1 C10.1 U5.1), 2_astabilny generator sygnalu (R1.1 T1.2 U1.4 U1.8), 3_Sterowanie kluczem (7 pins), 6_Glosnik (R21.2 TO1.5 U10.4 U10.8)
+12: 1_zasilanie (6 pins), 2_astabilny generator sygnalu (T2.3)
-5: 1_zasilanie (C13.2 U7.5), 4_Sonda+wzmacniacz (U8.4), 5_Wzmacniacz+Integrator (PR2.1 U9.4)
GND: 1_zasilanie (18 pins), 2_astabilny generator sygnalu (C1.1 C2.1 U1.1), 3_Sterowanie kluczem (16 pins), 4_Sonda+wzmacniacz (6 pins), 6_Glosnik (C16.2 C17.2 P3.1 U10.1)
NetC14_1: 3_Sterowanie kluczem (U4.8), 4_Sonda+wzmacniacz (C14.1 R13.2 U8.6)
NetP2_1: 2_astabilny generator sygnalu (R14.1 T2.2), 4_Sonda+wzmacniacz (P2.1 R9.2 R10.1)
NetPR2_3: 3_Sterowanie kluczem (U4.9), 5_Wzmacniacz+Integrator (PR2.3 U9.3)
NetR3_1: 2_astabilny generator sygnalu (R3.1 U1.3), 3_Sterowanie kluczem (U2.2 U3.2)
NetR16_1: 5_Wzmacniacz+Integrator (R16.1), 6_Glosnik (TO1.2)
NetR18_1: 5_Wzmacniacz+Integrator (R18.1), 6_Glosnik (TO1.1)